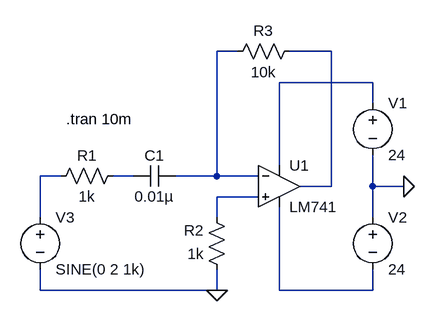
[diagram p0: schematic 9-diff.asc]
9-diff.asc, the LTspice schematic file:
Version 4.1
SHEET 1 880 680
WIRE 160 -32 128 -32
WIRE 304 -32 240 -32
WIRE 368 16 224 16
WIRE 368 48 368 16
WIRE 224 144 224 16
WIRE -112 160 -144 160
WIRE 0 160 -32 160
WIRE 128 160 128 -32
WIRE 128 160 64 160
WIRE 192 160 128 160
WIRE 304 176 304 -32
WIRE 304 176 256 176
WIRE 368 176 368 128
WIRE 416 176 368 176
WIRE 192 192 128 192
WIRE -144 224 -144 160
WIRE 128 224 128 192
WIRE 368 224 368 176
WIRE -144 336 -144 304
WIRE 128 336 -144 336
WIRE 128 336 128 304
WIRE 224 336 224 208
WIRE 368 336 368 304
WIRE 368 336 224 336
FLAG 416 176 0
FLAG 128 336 0
SYMBOL LM741 224 112 R0
SYMATTR InstName U1
SYMBOL voltage 368 32 R0
SYMATTR InstName V1
SYMATTR Value 24
SYMBOL voltage 368 208 R0
SYMATTR InstName V2
SYMATTR Value 24
SYMBOL voltage -144 208 R0
WINDOW 123 0 0 Left 0
WINDOW 39 0 0 Left 0
SYMATTR InstName V3
SYMATTR Value SINE(0 2 1k)
SYMBOL res -16 144 R90
WINDOW 0 0 56 VBottom 2
WINDOW 3 32 56 VTop 2
SYMATTR InstName R1
SYMATTR Value 1k
SYMBOL res 144 320 R180
WINDOW 0 36 76 Left 2
WINDOW 3 36 40 Left 2
SYMATTR InstName R2
SYMATTR Value 1k
SYMBOL cap 64 144 R90
WINDOW 0 0 32 VBottom 2
WINDOW 3 32 32 VTop 2
SYMATTR InstName C1
SYMATTR Value 0.01µ
SYMBOL res 256 -48 R90
WINDOW 0 0 56 VBottom 2
WINDOW 3 32 56 VTop 2
SYMATTR InstName R3
SYMATTR Value 10k
TEXT -104 72 Left 2 !.tran 10m

The netlist it stands for:
* 9-diff.asc
X§U1 N006 N001 N003 N007 N002 LM741  ; pins In+ In- V+ V- OUT
V1 N003 0 24
V2 0 N007 24
V3 N004 0 SINE(0 2 1k)
R1 N005 N004 1k
R2 0 N006 1k
C1 N001 N005 0.01µ
R3 N002 N001 10k
.tran 10m
.lib LM741.lib
.backanno
.end